# EAGLE design fonte12 (EAGLE 9.6.2)
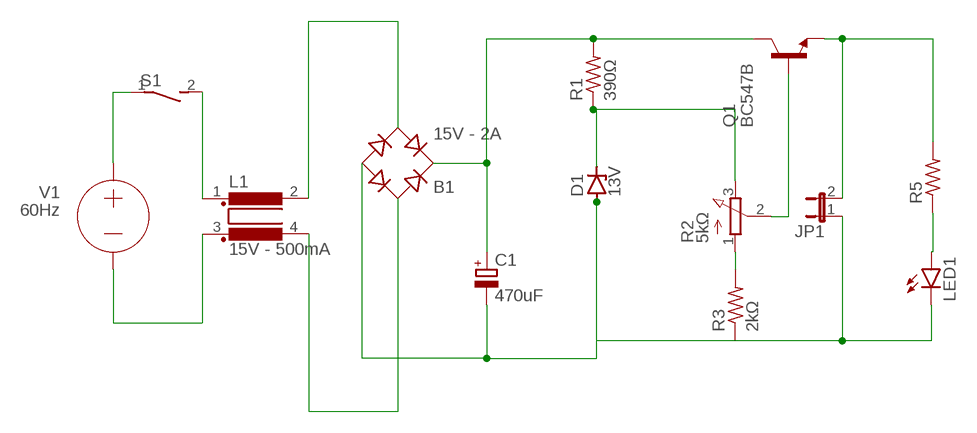
[diagram p0: schematic, sheet 1]

## Parts
B1  15V - 2A  RB1A  [RB1A]
C1  470uF  CPOL-EUE3.5-10  [E3,5-10]
D1  13V  ZENER-DIODEDO41Z10  [DO41Z10]
JP1  JP1E  [JP1]
L1  15V - 500mA  R1405VB2  [B2]
LED1  LED5MM  [LED5MM]
Q1  BC547B  [TO92]
R1  390Ω  R-US_0309/12  [0309/12]
R2  5kΩ  3RP/1610N  [3RP/1610N]
R3  2kΩ  R-US_0309/12  [0309/12]
R5  R-US_0309/12  [0309/12]
S1  DS01E  [DS-01]
V1  60Hz  VOLTAGE  (no package)

## Nets
N$1: R2.1(A) R3.2
N$2: S1.1 V1.+
N$3: JP1.2 Q1.1(E) R5.2
N$4: B1.AC2 L1.2
N$5: B1.AC1 L1.4
N$6: R3.1
N$7: B1.+ C1.+ Q1.3(C) R1.2
N$8: B1.- C1.- D1.A JP1.1 LED1.K(C)
N$9: D1.C R1.1 R2.3(E)
N$10: LED1.A R5.1
N$11: L1.1 S1.2
N$12: Q1.2(B) R2.2(S)
N$13: L1.3 V1.-

## Library data of the parts
B1 = rectifier:RB1A: RECTIFIER 1 A
C1 = rcl:CPOL-EU: POLARIZED CAPACITOR, European symbol; SPICEPREFIX: C
D1 = diode:ZENER-DIODE: Z-Diode
JP1 = jumper:JP1E: JUMPER
L1 = inductor-nkl:R1405V: Übertrager (verlustarm) bis typ. 400kHz Power transformer (low loss) up to typ. 400kHz; OC_FARNELL: unknown; OC_NEWARK: unknown
LED1 = led:LED: LED OSRAM: - CHIPLED LG R971, LG N971, LY N971, LG Q971, LY Q971, LO R971, LY R971 LH N974, LH R974 LS Q976, LO Q976, LY Q976 LO Q996 - Hyper CHIPLED LW Q18S LB Q993, LB Q99A, LB R99A - SideLED LS A670, LO A670, LY A670, LG A670, LP A670 LB A673, LV A673, LT A673, LW A673 LH A674 LY A675 LS A676, LA A676, LO A676, LY A676, LW A676 LS A679, LY A679, LG A679 - Hyper Micro SIDELED® LS Y876, LA Y876, LO Y876, LY Y876 LT Y87S - SmartLED LW L88C, LW L88S LB L89C, LB L89S, LG L890 LS L89K, LO L89K, LY L89K LS L896, LA L896, LO L896, LY L896 - TOPLED LS T670, LO T670, LY T670, LG T670, LP T670 LSG T670, LSP T670, LSY T670, LOP T670, LYG T670 LG T671, LOG T671, LSG T671 LB T673, LV T673, LT T673, LW T673 LH T674 LS T676, LA T676, LO T676, LY T676, LB T676, LH T676, LSB T676, LW T676 LB T67C, LV T67C, LT T67C, LS T67K, LO T67K, LY T67K, LW E67C LS E67B, LA E67B, LO E67B, LY E67B, LB E67C, LV E67C, LT E67C LW T67C LS T679, LY T679, LG T679 LS T770, LO T770, LY T770, LG T770, LP T770 LB T773, LV T773, LT T773, LW T773 LH T774 LS E675, LA E675, LY E675, LS T675 LS T776, LA T776, LO T776, LY T776, LB T776 LHGB T686 LT T68C, LB T68C - Hyper Mini TOPLED® LB M676 - Mini TOPLED Santana® LG M470 LS M47K, LO M47K, LY M47K Source: http://www.osram.convergy.de LUXEON: - LUMILED® LXK2-PW12-R00, LXK2-PW12-S00, LXK2-PW14-U00, LXK2-PW14-V00 LXK2-PM12-R00, LXK2-PM12-S00, LXK2-PM14-U00 LXK2-PE12-Q00, LXK2-PE12-R00, LXK2-PE12-S00, LXK2-PE14-T00, LXK2-PE14-U00 LXK2-PB12-K00, LXK2-PB12-L00, LXK2-PB12-M00, LXK2-PB14-N00, LXK2-PB14-P00, LXK2-PB14-Q00 LXK2-PR12-L00, LXK2-PR12-M00, LXK2-PR14-Q00, LXK2-PR14-R00 LXK2-PD12-Q00, LXK2-PD12-R00, LXK2-PD12-S00 LXK2-PH12-R00, LXK2-PH12-S00 LXK2-PL12-P00, LXK2-PL12-Q00, LXK2-PL12-R00 Source: www.luxeon.com KINGBRIGHT: KA-3528ASYC Source: www.kingbright.com
Q1 = transistor-npn:BC547*: NPN Transistor
R1 R3 R5 = rcl:R-US_: RESISTOR, American symbol; SPICEPREFIX: R
R2 = pot:3RP/1610N: 16mm Potentiometer one level Source: http://www.alphapotentiometers.net/html/16mm_pot_2.html
S1 = switch-dil:DS01E: DIL/CODE SWITCH; OC_FARNELL: unknown; OC_NEWARK: unknown
V1 = ngspice-simulation:VOLTAGE: Independent Voltage Source, either DC, AC, PULSE, SINE, PWL, EXP, or SFFM; VALUE: 0V

## Board
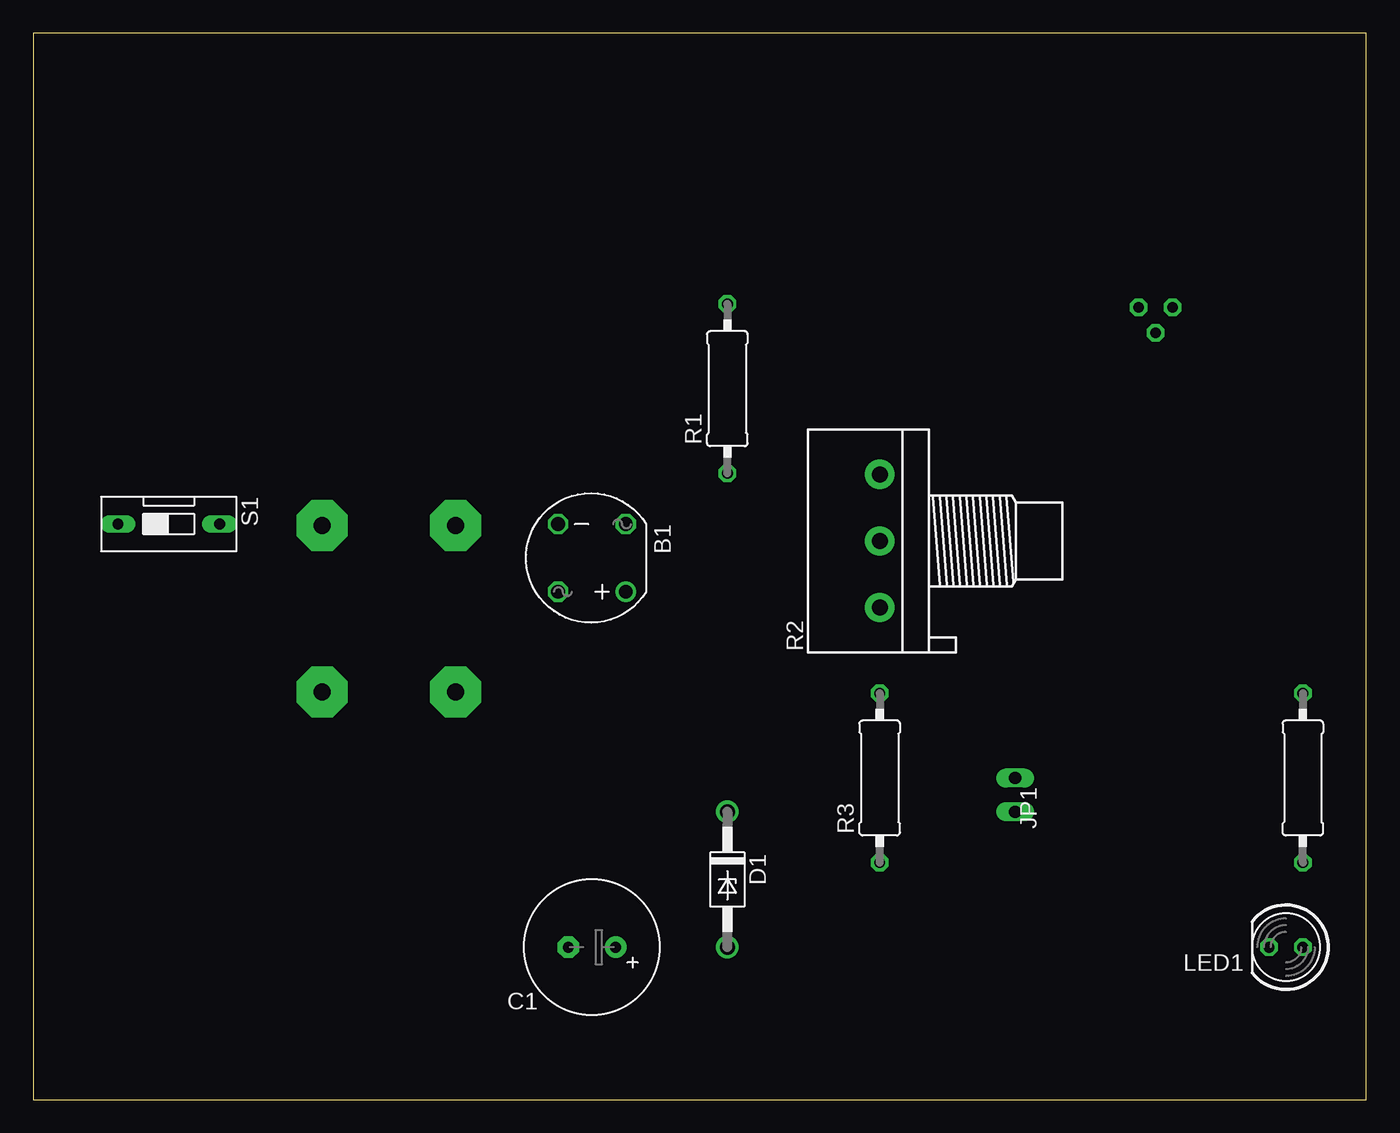
[diagram p1: board, top side]
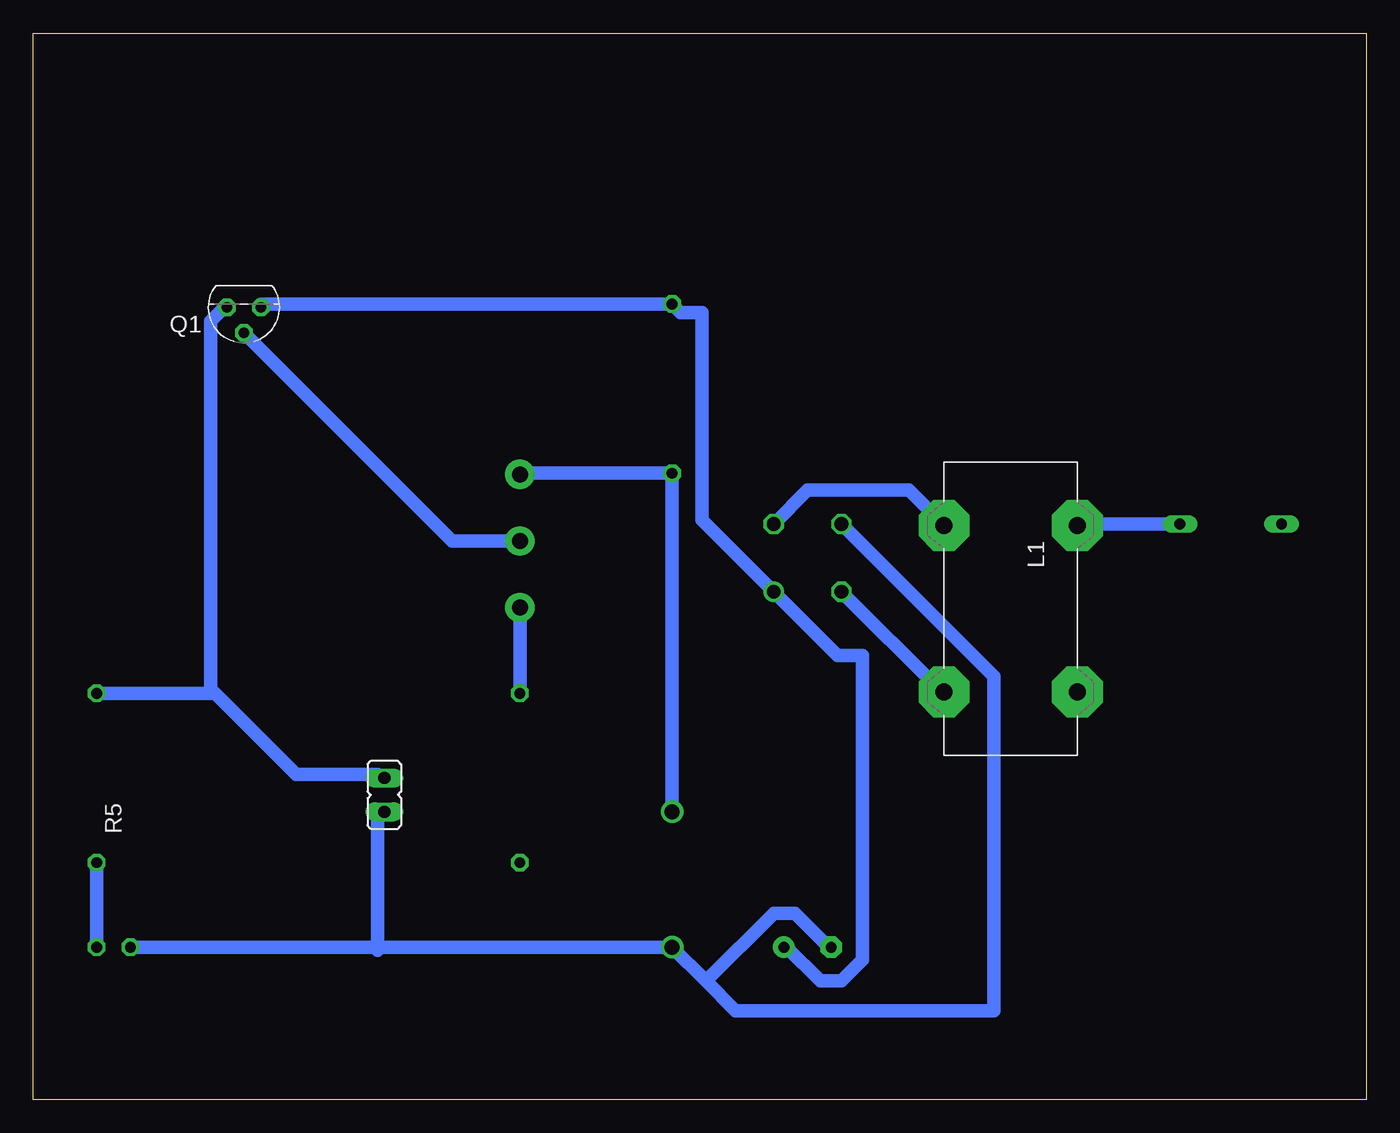
[diagram p2: board, bottom side, seen from below]

Size 100 x 80 mm. Coordinates in mm from the lower left corner, seen from the top.
Outline: 0,0 100,0 100,80 0,80 0,0
Copper layers (1*16): Top 0.035mm / dielectric 1.5mm / Bottom 0.035mm
Design rules "default *": minimum track width 40mil, minimum drill 0.35mm, track to track 40mil, track to pad 40mil, pad to pad 40mil, via to via 40mil, smd to smd 6mil, copper to edge 40mil, drill to drill 6mil, minimum pad ring 10mil, minimum via ring 8mil, stop-mask expansion 4mil, vias tented up to drill 0mil, thermal gap 10mil

### Footprints (pad centres in the part's own frame; a part is rotated, then mirrored left to right if it is on the bottom)
RB1A = drill 1.016: + -2.54,2.54 | drill 1.016 octagon: - 2.54,-2.54; AC1 2.54,2.54; AC2 -2.54,-2.54
E3,5-10 = drill 0.813 pad 1.6: + -1.778,0 | drill 0.813 pad 1.6 octagon: - 1.778,0
DO41Z10 = drill 1.118: A 5.08,0; C -5.08,0
JP1 = drill 0.914 long: 1 0,-1.27; 2 0,1.27
B2 = drill 1.27 pad 3.81 octagon: 1 -6.25,5; 2 -6.25,-5; 3 6.25,5; 4 6.25,-5
LED5MM = drill 0.813 octagon: A -1.27,0; K 1.27,0
TO92 = drill 0.813 octagon: 1 1.27,0; 2 0,1.905; 3 -1.27,0
0309/12 = drill 0.813 octagon: 1 -6.35,0; 2 6.35,0
3RP/1610N = drill 1.2 pad 2.184: 1 -5,0; 2 0,0; 3 5,0
DS-01 = drill 0.813 long: 1 0,-3.81; 2 0,3.81

### Placement (x,y rotation side)
B1  41.91,40.64 180 top
C1  41.91,11.43 180 top
D1  52.07,16.51 270 top
JP1  73.66,22.86 0 bottom
L1  26.67,36.83 270 bottom
LED1  93.98,11.43 180 top
Q1  84.2,59.44 180 bottom
R1  52.07,53.34 90 top
R2  63.5,41.91 90 top
R3  63.5,24.13 90 top
R5  95.25,24.13 90 top
S1  10.16,43.18 270 top

### Tracks (layer width: path | path; a pad name or v marks a point on that pad's centre or on a via)
N$1
  Bottom 1.016: R2.1 R3.2
N$3
  Bottom 1.016: R5.2 86.68,30.48 | 86.68,30.48 86.68,58.42 85.72,59.37 Q1.1 | JP1.2 74.17,24.38 80.26,24.38 86.36,30.48 86.68,30.48
N$4
  Bottom 1.016: B1.AC2 41.91,45.72 34.29,45.72 31.75,43.18 L1.2
N$5
  Bottom 1.016: B1.AC1 32.07,30.8 31.75,30.8 L1.4
N$7
  Bottom 1.016: Q1.3 82.87,59.69 R1.2 51.44,59.05 49.85,59.05 49.85,43.5 B1.+ 39.69,33.34 37.78,33.34 37.78,10.48 39.37,8.89 40.96,8.89 43.5,11.43 C1.+
N$8
  Bottom 1.016: 74.17,11.43 D1.A 49.53,8.89 | 74.17,11.43 LED1.K | B1.- 27.94,31.75 27.94,6.67 47.31,6.67 49.53,8.89 | 49.53,8.89 44.45,13.97 42.86,13.97 40.32,11.43 C1.- | 74.17,11.43 74.17,21.34 JP1.1 | 74.17,11.18 74.17,11.43
N$9
  Bottom 1.016: R2.3 63.5,46.99 R1.1 D1.C
N$10
  Bottom 1.016: R5.1 LED1.A
N$11
  Bottom 1.016: S1.2 21.59,43.18 L1.1
N$12
  Bottom 1.016: Q1.2 68.58,41.91 R2.2